# EasyEDA schematic SCH_ESP-CellCore_USB_Interlock_RevA2_CLEAN.json
TITLE: Sheet_1; REV: 1.0; Date: 2026-08-07; Sheet: 1/1; Drawn By: evilroot; Company: Your Company
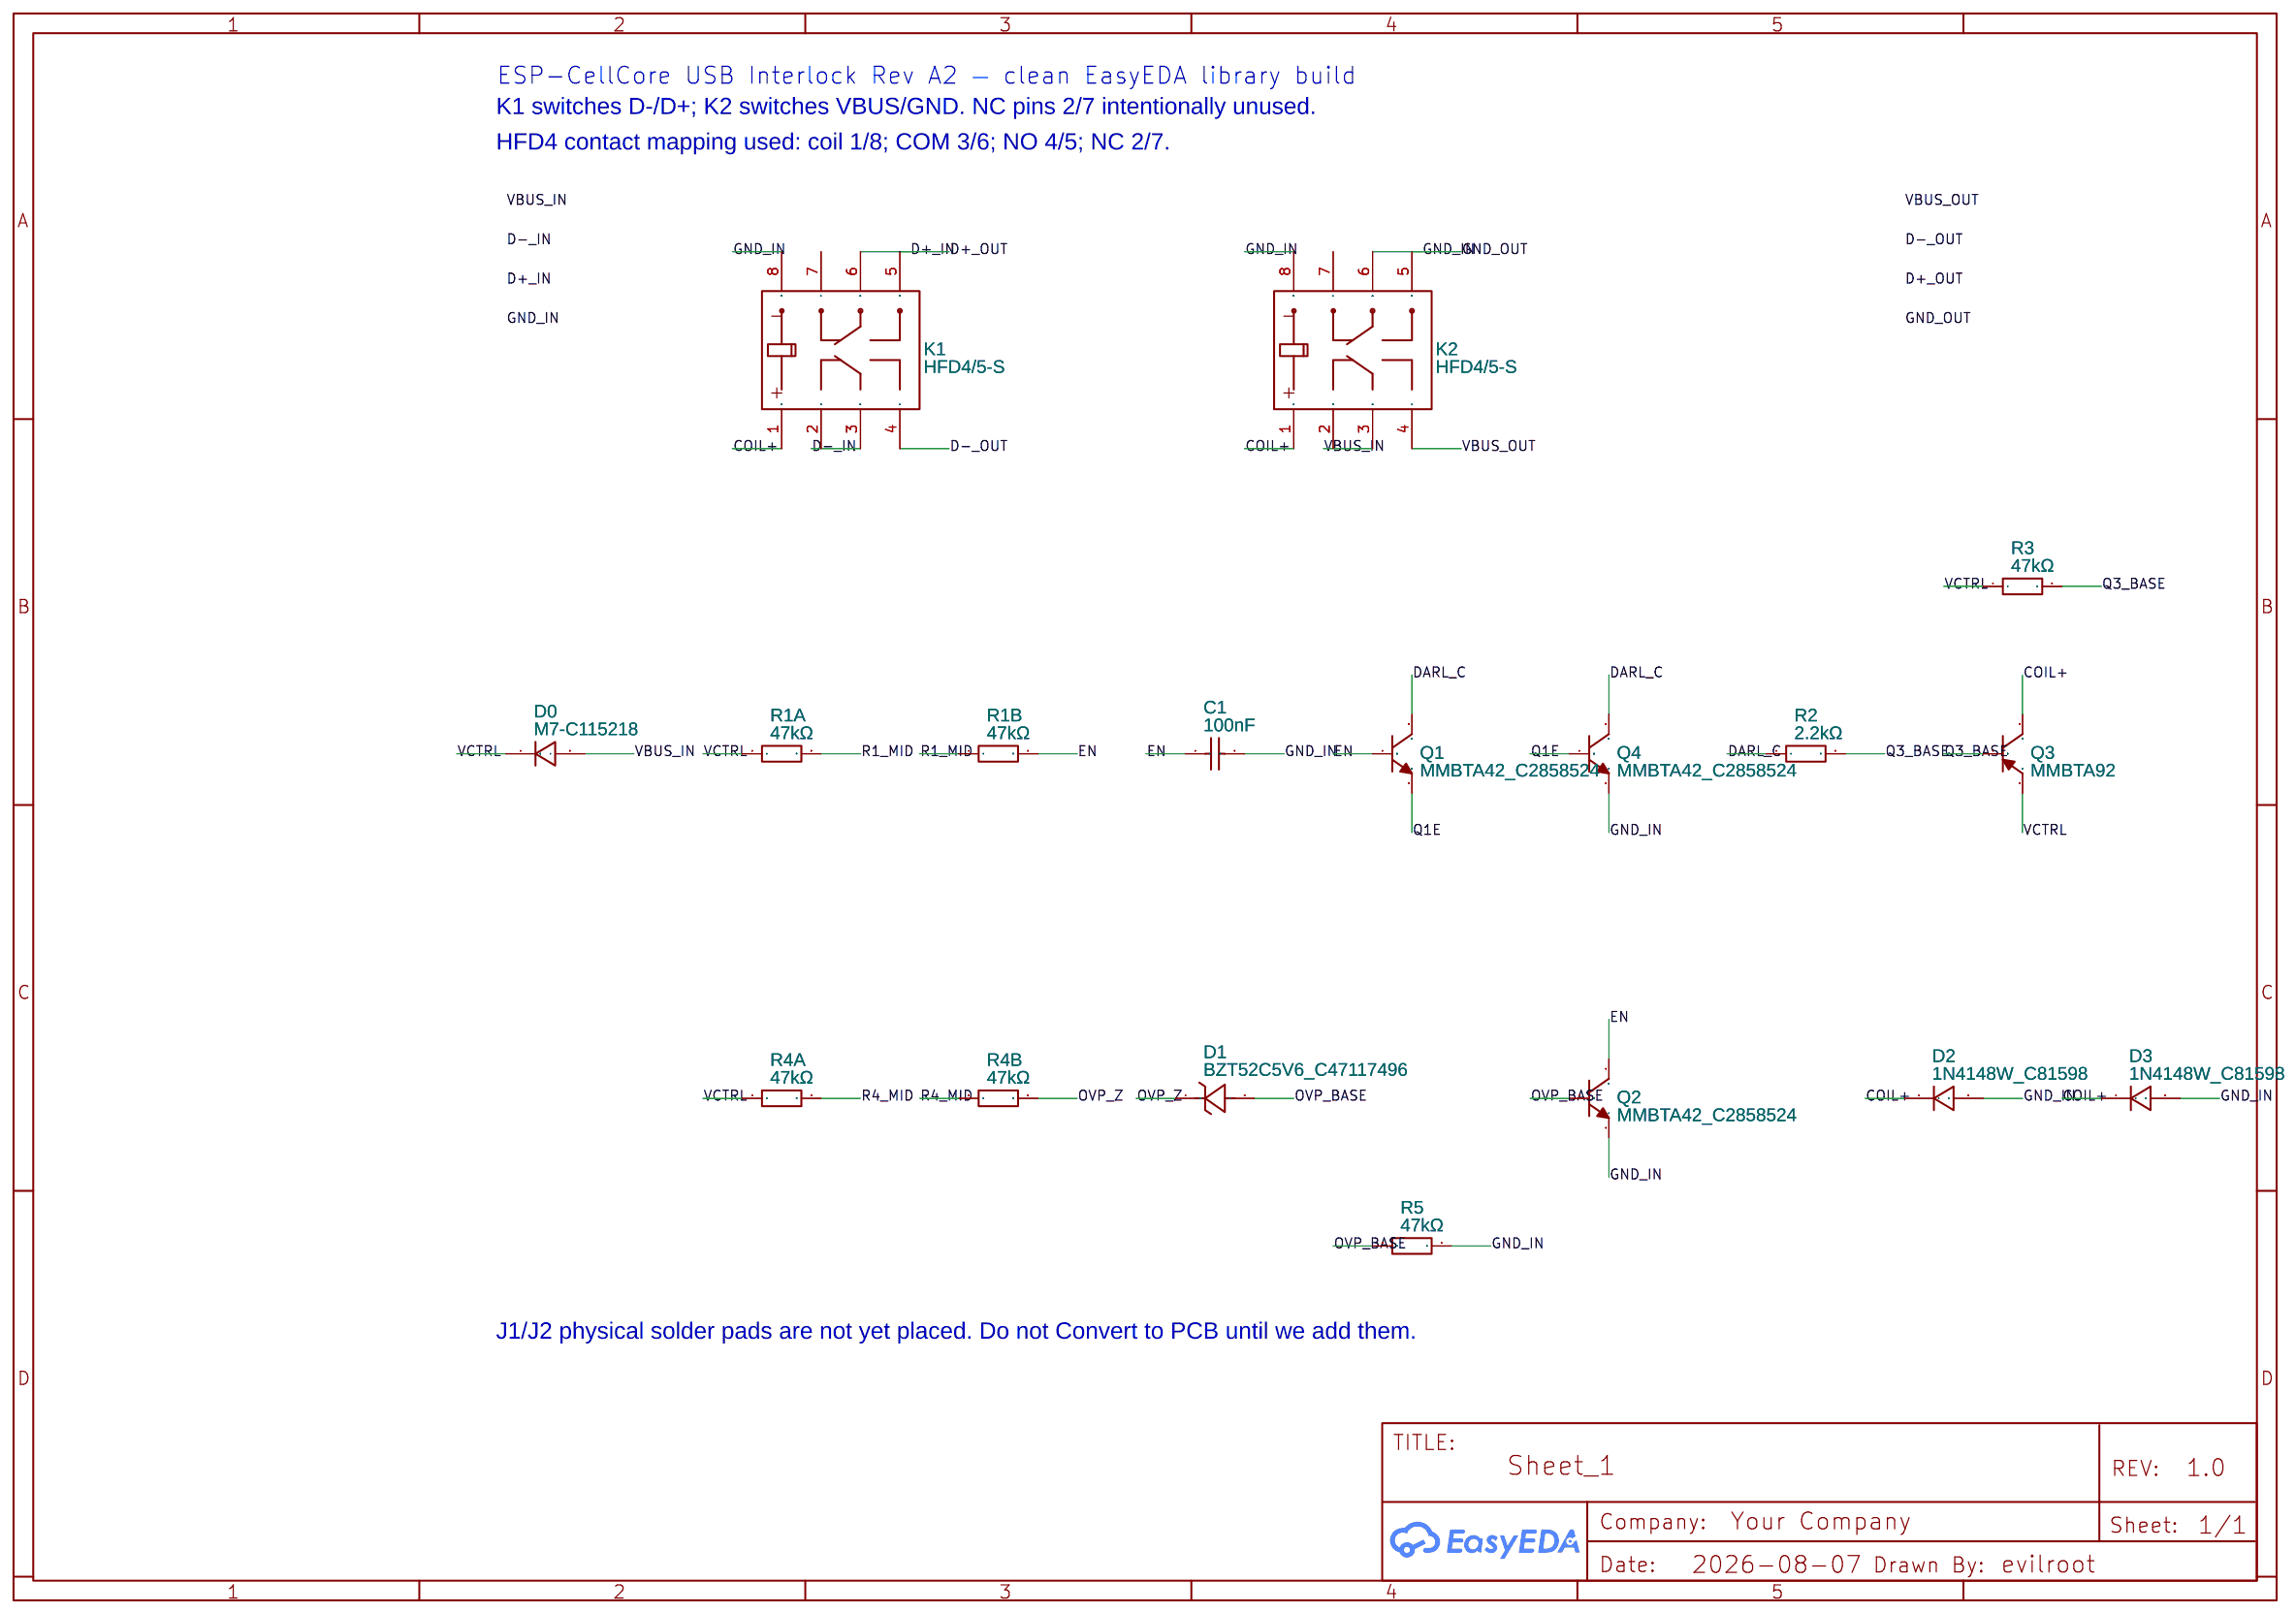
[diagram p0: schematic sheet]

## Parts
C1  100nF  [C0805]
D0  M7-C115218  [SMA_L4.4-W2.6-LS5.0-RD]
D1  BZT52C5V6_C47117496  [SOD-123_L2.7-W1.6-LS3.7-RD]
D2  1N4148W_C81598  [SOD-123F_L2.7-W1.6-LS3.8-RD]
D3  1N4148W_C81598  [SOD-123F_L2.7-W1.6-LS3.8-RD]
K1  HFD4/5-S  [RELAY-SMD_HFD4-5-SR]
K2  HFD4/5-S  [RELAY-SMD_HFD4-5-SR]
Q1  MMBTA42_C2858524  [SOT-23-3_L2.9-W1.5-P1.90-LS2.6-BR]
Q2  MMBTA42_C2858524  [SOT-23-3_L2.9-W1.5-P1.90-LS2.6-BR]
Q3  MMBTA92  [SOT-23-3_L2.9-W1.3-P1.90-LS2.4-BR]
Q4  MMBTA42_C2858524  [SOT-23-3_L2.9-W1.5-P1.90-LS2.6-BR]
R1A  47kΩ  [R0805]
R1B  47kΩ  [R0805]
R2  2.2kΩ  [R0805]
R3  47kΩ  [R0805]
R4A  47kΩ  [R0805]
R4B  47kΩ  [R0805]
R5  47kΩ  [R0805]

## Library data of the parts
C1 = C0805C104K5RACTU: Contributor: LCSC; Supplier: LCSC; Manufacturer: KEMET(基美); Manufacturer Part: C0805C104K5RAC7800; Supplier Part: C75414; JLCPCB Part Class: Extended Part
D0 = M7-C115218: Contributor: LCSC; Supplier: LCSC; Supplier Part: C115218; Manufacturer: 晶导微电子; Manufacturer Part: M7; JLCPCB Part Class: Extended Part
D1 = BZT52C5V6_C47117496: Supplier: LCSC; Supplier Part: C47117496; Manufacturer: baocheng(宝乘); Manufacturer Part: BZT52C5V6; JLCPCB Part Class: Extended Part; Contributor: lcsc
D2 D3 = 1N4148W_C81598: Supplier: LCSC; Manufacturer: ST(先科); Manufacturer Part: 1N4148W; Supplier Part: C81598; JLCPCB Part Class: Basic Part
K1 K2 = HFD4/5-S: Supplier: LCSC; Manufacturer: HF(宏发); Manufacturer Part: HFD4/5-SR; Supplier Part: C64399; JLCPCB Part Class: Extended Part
Q1 Q2 Q4 = MMBTA42_C2858524: Contributor: LCSC; Supplier: LCSC; Supplier Part: C2858524; Manufacturer: MDD(辰达半导体); Manufacturer Part: MMBTA42; JLCPCB Part Class: Extended Part
Q3 = MMBTA92: Contributor: LCSC; Supplier: LCSC; Supplier Part: C909761; Manufacturer: GOODWORK(固得沃克); JLCPCB Part Class: Extended Part
R1A R1B R3 R4A R4B R5 = AC0805FR-0747KL: Contributor: LCSC; Supplier: LCSC; Manufacturer: YAGEO(国巨); Supplier Part: C144558; JLCPCB Part Class: Extended Part
R2 = 0805W8F2201T5E: Supplier: LCSC; Manufacturer: UNI-ROYAL(厚声); Supplier Part: C17520; JLCPCB Part Class: Basic Part

## Nets
GND_IN: C1.2 D2.2(A) D3.2(A) K1.8 K2.5 K2.6 K2.8 Q2.2(E) Q4.2(E) R5.2
VBUS_IN: D0.2(A) K2.3
VBUS_OUT: K2.4
COIL+: D2.1(K) D3.1(K) K1.1 K2.1 Q3.3(C)
D+_IN: K1.5 K1.6
D-_IN: K1.3
D-_OUT: K1.4
DARL_C: Q1.3(C) Q4.3(C) R2.1
EN: C1.1 Q1.1(B) Q2.3(C) R1B.2
OVP_BASE: D1.2(A) Q2.1(B) R5.1
OVP_Z: D1.1(C) R4B.2
Q1E: Q1.2(E) Q4.1(B)
Q3_BASE: Q3.1(B) R2.2 R3.2
R1_MID: R1A.2 R1B.1
R4_MID: R4A.2 R4B.1
VCTRL: D0.1(C) Q3.2(E) R1A.1 R3.1 R4A.1

Not connected (* = marked no-connect by the designer): K1 2 7; K2 2 7

## Notes on the sheet
- ESP-CellCore USB Interlock Rev A2 — clean EasyEDA library build
- K1 switches D-/D+; K2 switches VBUS/GND. NC pins 2/7 intentionally unused.
- HFD4 contact mapping used: coil 1/8; COM 3/6; NO 4/5; NC 2/7.
- J1/J2 physical solder pads are not yet placed. Do not Convert to PCB until we add them.
